# Altium schematic sheet Sheet2.SchDoc
size A
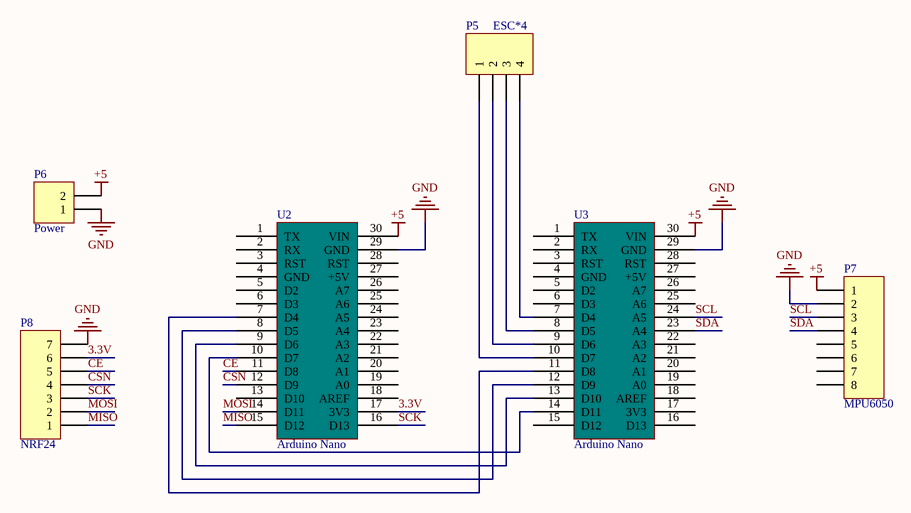
[diagram p0: Sheet2.SchDoc]

## Parts
P5  ESC*4  [HDR1X4]
P6  Power  [HDR1X2]
P7  MPU6050  [HDR1X8]
P8  NRF24  [HDR1X7]
U2  Arduino Nano  [PCBComponent_1]
U3  Arduino Nano  [PCBComponent_1]

## Nets
+5: P6.2 P7.1 U2.30(VIN) U3.30(VIN)
GND: P6.1 P7.2 P8.7 U2.29(GND) U3.29(GND)
3.3V: P8.6 U2.17(3V3)
CE: P8.5 U2.11(D8)
CSN: P8.4 U2.12(D9)
MISO: P8.1 U2.15(D12)
MOSI: P8.2 U2.14(D11)
SCK: P8.3 U2.16(D13)
SCL: P7.3 U3.24(A5)
SDA: P7.4 U3.23(A4)
NetP5_1: P5.1 U3.10(D7)
NetP5_2: P5.2 U3.9(D6)
NetP5_3: P5.3 U3.8(D5)
NetP5_4: P5.4 U3.7(D4)
NetU2_7: U2.7(D4) U3.11(D8)
NetU2_8: U2.8(D5) U3.12(D9)
NetU2_9: U2.9(D6) U3.13(D10)
NetU2_10: U2.10(D7) U3.14(D11)

Not connected (* = marked no-connect by the designer): P7 5 6 7 8; U2 1(TX) 2(RX) 3(RST) 4(GND) 5(D2) 6(D3) 13(D10) 18(AREF) 19(A0) 20(A1) 21(A2) 22(A3) 23(A4) 24(A5) 25(A6) 26(A7) 27(+5V) 28(RST); U3 1(TX) 2(RX) 3(RST) 4(GND) 5(D2) 6(D3) 15(D12) 16(D13) 17(3V3) 18(AREF) 19(A0) 20(A1) 21(A2) 22(A3) 25(A6) 26(A7) 27(+5V) 28(RST)

## Library data of the parts
P5 = Header 4: Header, 4-Pin; LatestRevisionDate: 17-Jul-2002; LatestRevisionNote: Re-released for DXP Platform.; Publisher: Altium Limited
P6 = Header 2: Header, 2-Pin; LatestRevisionDate: 17-Jul-2002; LatestRevisionNote: Re-released for DXP Platform.; Publisher: Altium Limited
P7 = Header 8: Header, 8-Pin; LatestRevisionDate: 17-Jul-2002; LatestRevisionNote: Re-released for DXP Platform.; Publisher: Altium Limited
P8 = Header 7: Header, 7-Pin; LatestRevisionDate: 17-Jul-2002; LatestRevisionNote: Re-released for DXP Platform.; Publisher: Altium Limited
U2 U3 = Component_1